# EAGLE design mqtt doorbell v2a (EAGLE 7.6.0)
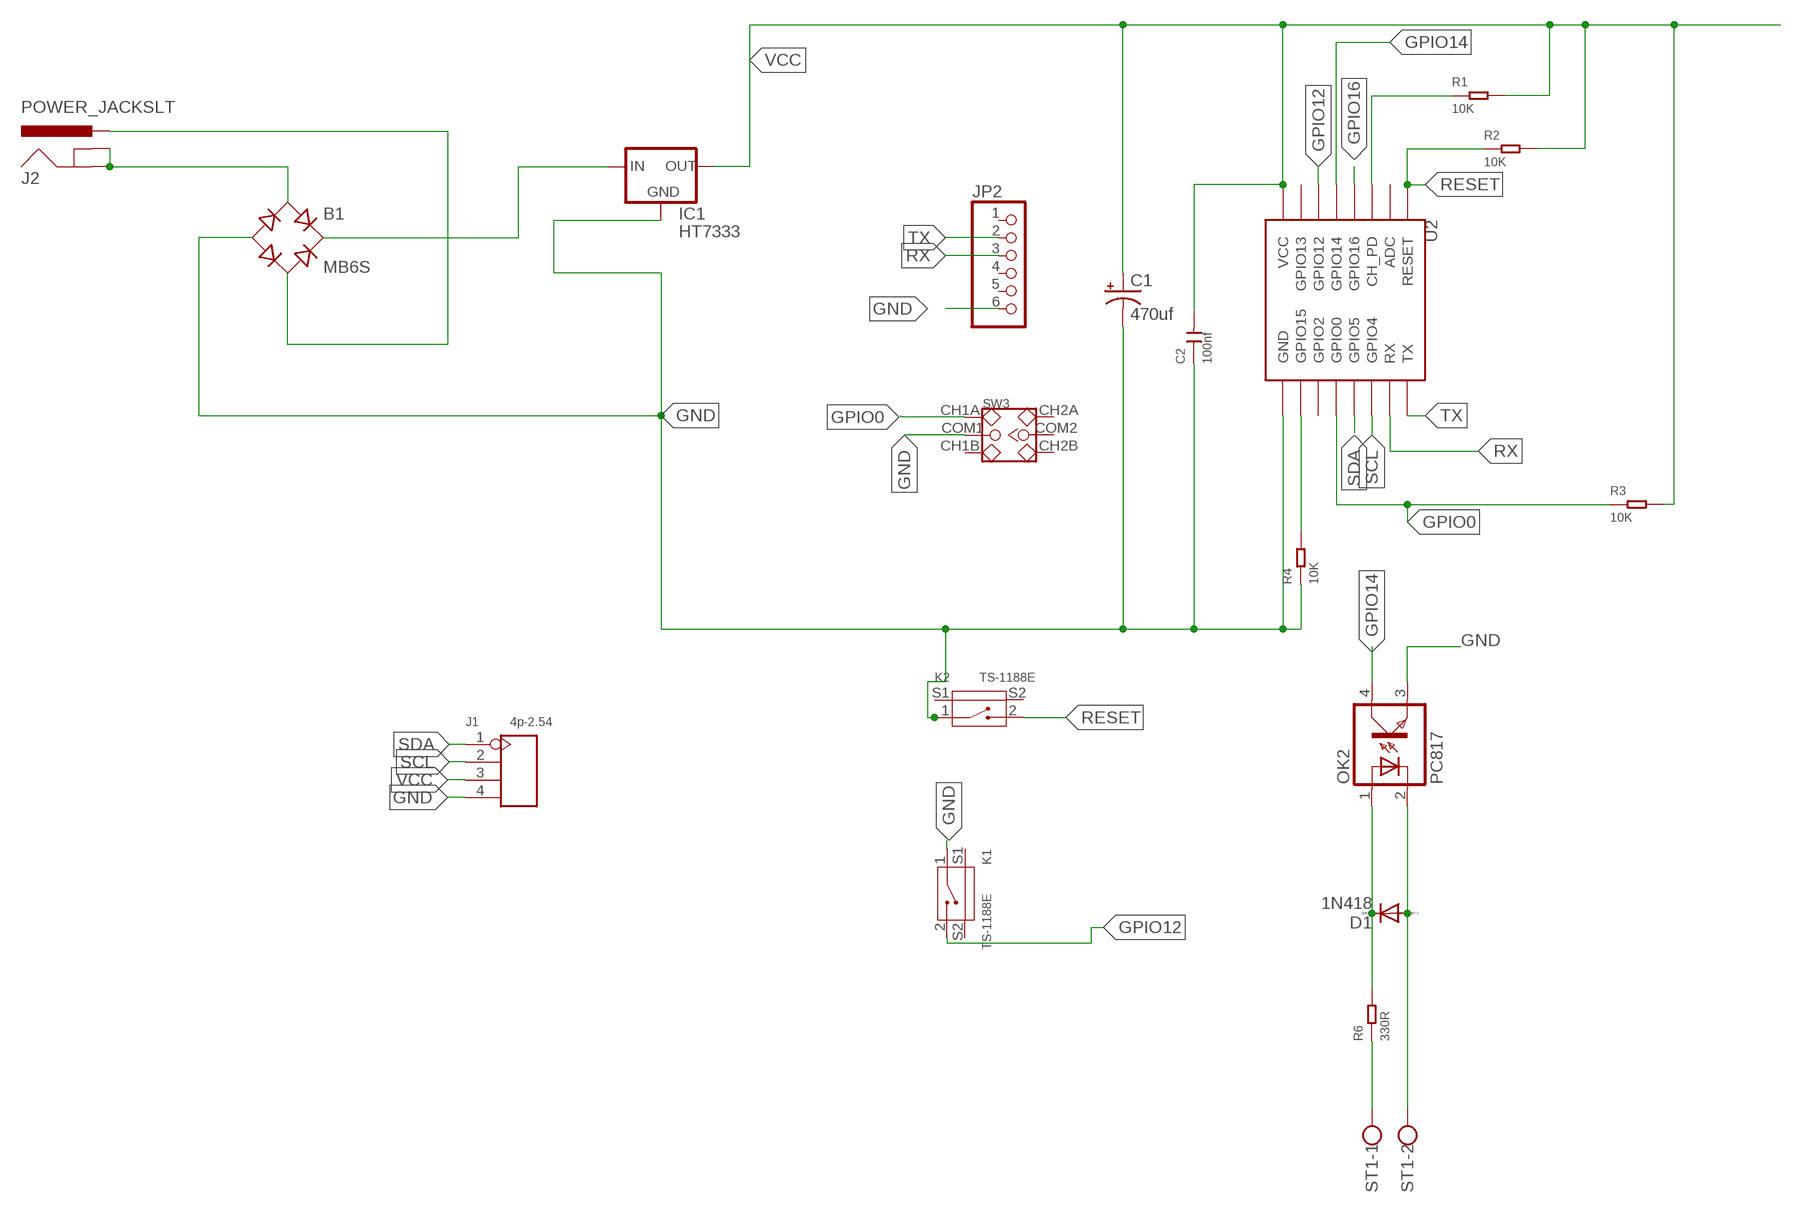
[diagram p0: schematic, sheet 1]

## Parts
B1  MB6S  MB4S  [SOIC-4]
C1  470uf  47UF-50V-20%(ELECT)  [PANASONIC_D]
C2  100nf  CERAMIC-100NF-50V-10%-X7R(0603)  [C0603]
D1  1N418  CGRM4001-G  [SOD-123_MINI-SMA]
IC1  HT7333  [SOT-89]
J1  4p-2.54  DIP-BLACK-FEMALE-HEADER-VERT(4P-2.54)  [H4-2.54]
J2  POWER_JACKSLT  [POWER_JACK_SLOT]
JP2  PINHD-1X6  [1X06]
K1  TS-1188E  SMD-BUTTON(2+2P-7X3.5MM-90D)  [SW4-SMD-7.0X3.5X3.5MM-90D]
K2  TS-1188E  SMD-BUTTON(2+2P-7X3.5MM-90D)  [SW4-SMD-7.0X3.5X3.5MM-90D]
OK2  PC817  TLP181  [SOP-4-2.54]
R1  10K  SMD-RES-10K-1%-1/10W(0603)  [R0603]
R2  10K  SMD-RES-10K-1%-1/10W(0603)  [R0603]
R3  10K  SMD-RES-10K-1%-1/10W(0603)  [R0603]
R4  10K  SMD-RES-10K-1%-1/10W(0603)  [R0603]
R6  330R  SMD-RES-330R-1%-1/10W(0603)  [R0603]
ST1  W237-102  [W237-102]
SW3  SMD-TOGGLE-SWITCH-2CH(2X3P-7X3.5MM)  [SW6-2.54-SMD-7.0X3.5X1.5MM]
U2  ESP12SMD  [ESP12-SMD]

## Nets
GND: B1.- C1.- C2.1 IC1.2(GND) J1.4 JP2.6 K1.1 K2.1 OK2.3(EMIT) R4.1 SW3.COM1 U2.GND
GPIO0: R3.1 SW3.CH1A U2.GPIO0
GPIO12: K1.2 U2.GPIO12
GPIO14: OK2.4(COL) U2.GPIO14
GPIO16: U2.GPIO16
L1: B1.+ IC1.3(IN) IC1.4(IN)
N$1: B1.~2(AC2) J2.PWR
N$3: D1.C OK2.1(A) R6.2
N$4: D1.A OK2.2(C) ST1.2
N$5: R1.1 U2.CH_PD
N$6: R6.1 ST1.1
N$7: R4.2 U2.GPIO15
N$9: B1.~1(AC1) J2.GND@1(GNDBREAK) J2.GND@2(GND)
RESET: K2.2 R2.1 U2.RESET
RX: JP2.3 U2.RXD0(RX)
SCL: J1.2 U2.GPIO4
SDA: J1.1 U2.GPIO5
TX: JP2.2 U2.TXD0(TX)
VCC: C1.+ C2.2 IC1.1(OUT) J1.3 R1.2 R2.2 R3.2 U2.VCC
Unconnected: JP2.1 JP2.4 JP2.5 K1.S1 K1.S2 K2.S1 K2.S2 SW3.CH1B SW3.CH2A SW3.CH2B SW3.COM2 U2.ADC U2.GPIO2 U2.GPIO13

## Library data of the parts
B1 = rectifier:MB*S: Bridge Rectifier Source: http://www.fairchildsemi.com/ds/MB/MB6S.pdf
C1 = SparkFun-Capacitors:47UF-50V-20%(ELECT): CAP-10547; PROD_ID: CAP-10547
C2 = Seeed-Capacitor:CERAMIC-100NF-50V-10%-X7R(0603): 302010138; MPN: CC0603KRX7R9BB104
D1 = diode:CGRM400*-G: Molded plasitc,JEDEC SOD-123/Mini SMA Source: Comchip CGRM4001-G.pdf
IC1 = Lemcke solutions:HT73*
J1 = Seeed-OPL-Connector:DIP-BLACK-FEMALE-HEADER-VERT(4P-2.54): 320030017; MPN: F185-1104A1BSYA1
J2 = Lemcke solutions:POWER_JACK: Power Jack Connector This is the standard 5.5mm barrel jack for power. The PTH is the most common, proven, reliable, footprint. The Slot footprint only works if the mill layer is transmitted to the PCB fab house so be warned. Here are the connectors we sell at SparkFun: DC Barrel Power Jack/Connector <https://www.sparkfun.com/products/119> (PRT-00119) DC Barrel Power Jack/Connector (SMD) <https://www.sparkfun.com/products/12748> (PRT-12748) DC Barrel Jack Adapter - Breadboard Compatible <https://www.sparkfun.com/products/10811> (PRT-10811) It is used on this SparkFun product (and many, many others): SparkFun RedBoard - Programmed with Arduino <https://www.sparkfun.com/products/12757> (DEV-12757) Also, if you need a mating power supply or connector, please check these out: Wall Adapter Power Supply - 9VDC 650mA <https://www.sparkfun.com/products/298> (TOL-00298) DC Barrel Jack Adapter - Male <https://www.sparkfun.com/products/10287> (PRT-10287); PROD_ID: PRT-00119
JP2 = pinhead:PINHD-1X6: PIN HEADER
K1 K2 = Seeed-Switch:SMD-BUTTON(2+2P-7X3.5MM-90D): 311020023; MPN: TS-1188E
OK2 = optocoupler:TLP181
R1-R4 = Seeed-Resistor:SMD-RES-10K-1%-1/10W(0603): 301010299; MPN: RC0603FR-0710KL
R6 = Seeed-Resistor:SMD-RES-330R-1%-1/10W(0603): 301010300; MPN: RC0603FR-07330RL
ST1 = con-wago-500:W237-102: WAGO SCREW CLAMP; MPN: 237-102; OC_FARNELL: unknown; OC_NEWARK: 70K9898
SW3 = Seeed-Switch:SMD-TOGGLE-SWITCH-2CH(2X3P-7X3.5MM): 311030005
U2 = esp8266modules:ESP12: ESP8266 Wifi module 12

## Net classes
0 default: width 0.203 mm, clearance 0.205 mm

## Board
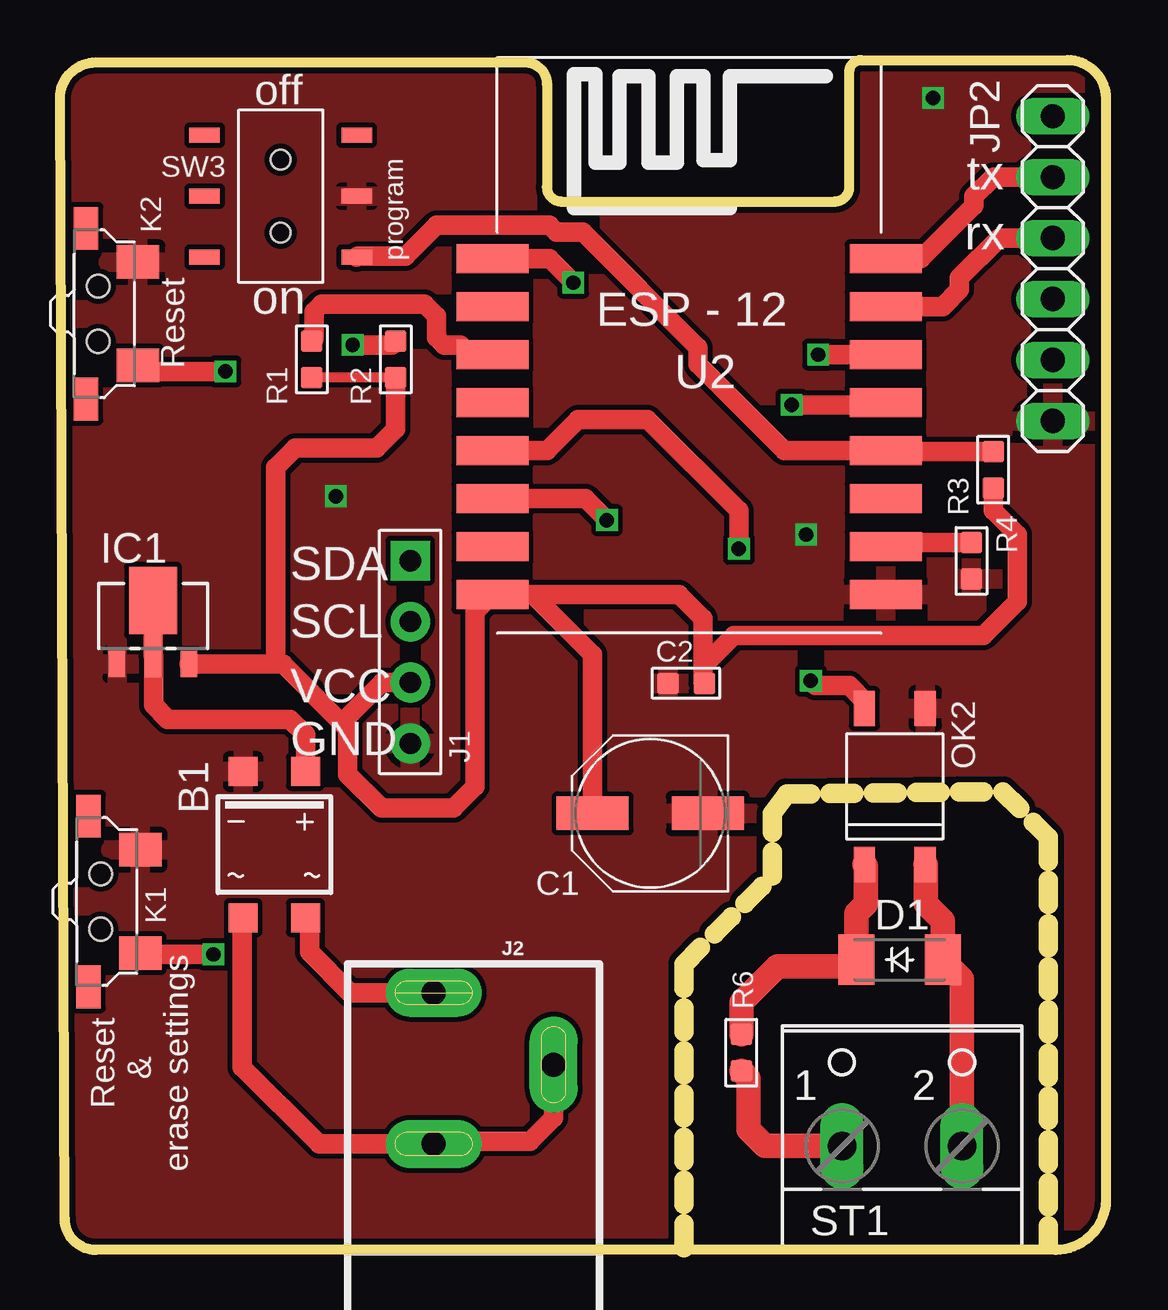
[diagram p1: board, top side]
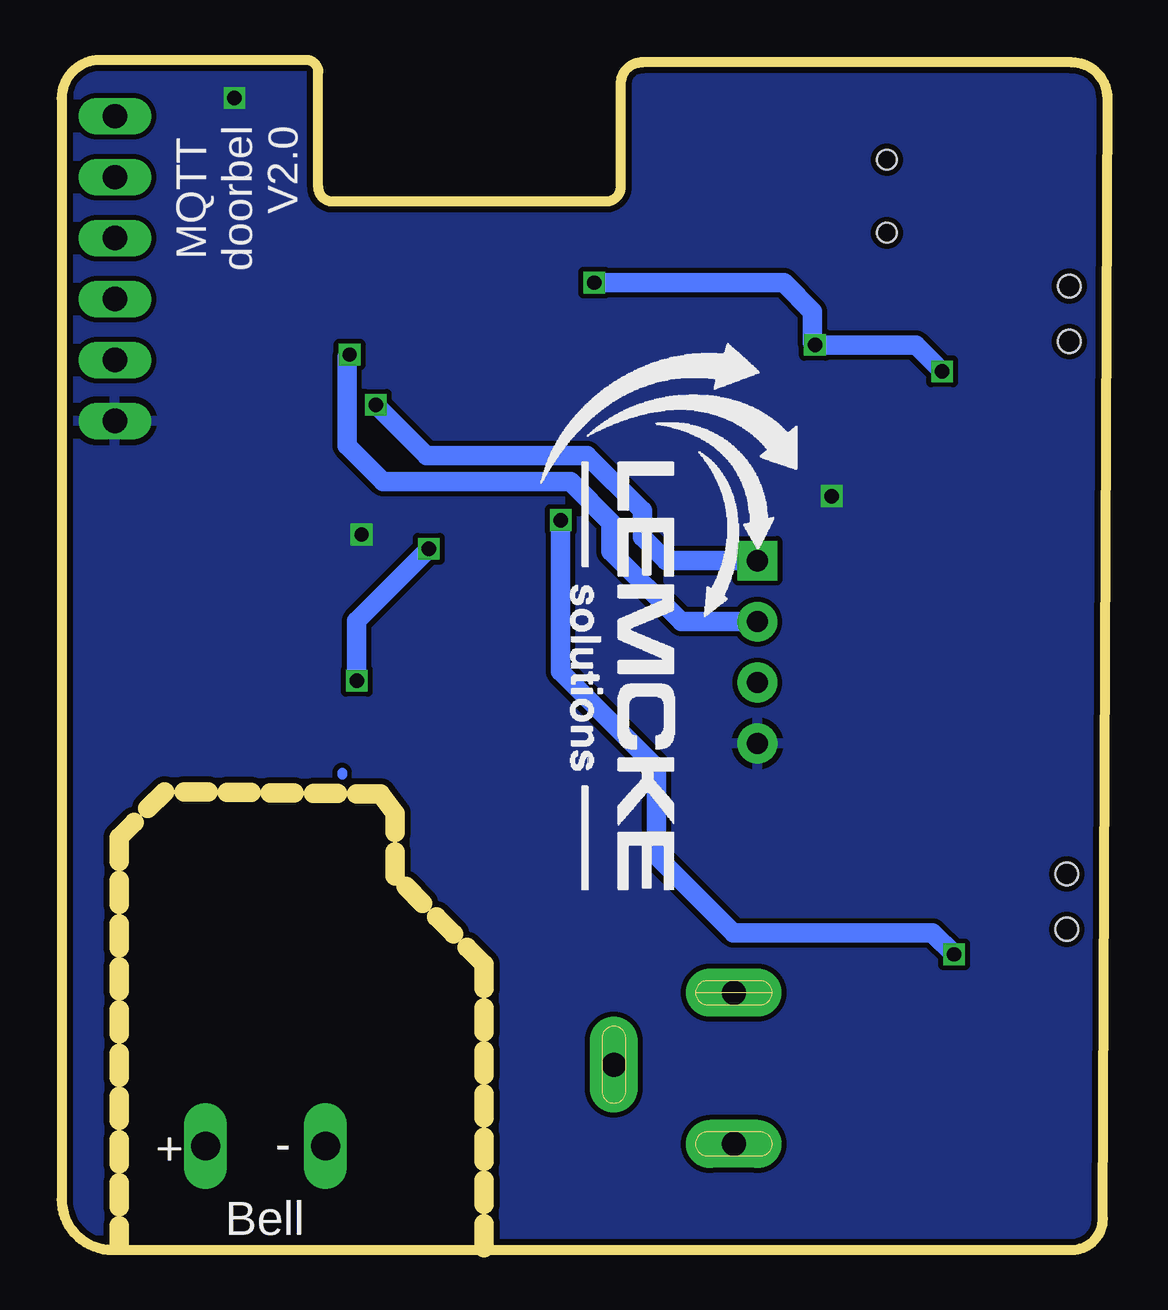
[diagram p2: board, bottom side, seen from below]

Size 43.6 x 49.6 mm. Coordinates in mm from the lower left corner, seen from the top.
Outline: 26,0.1 26,11.9 29.7,15.6 29.7,18.2 30.3,19 39.3,19.1 41.2,17.2 41.2,0.3
Outline: 0.2,1.3 0,48 arc-90 1.5,49.5 19.4,49.5 arc-90 20.3,48.6 20.3,44.3 arc90 20.9,43.7 32.3,43.7 arc90 32.9,44.3 32.9,49.1 arc-90 33.4,49.6 42,49.6 arc-90 43.6,48 43.6,2.1 arc-90 41.5,0 1.5,0 arc-90 0.2,1.3
Copper layers (1*16): Top 0.035mm / dielectric 1.5mm / Bottom 0.035mm
Design rules "SeeedStudio_2layer_DRU_no_angle_20140221": minimum track width 6mil, minimum drill 12mil, track to track 6mil, track to pad 6mil, pad to pad 6mil, via to via 6mil, smd to smd 0mil, copper to edge 10mil, drill to drill 10mil, minimum pad ring 10mil, minimum via ring 6mil, stop-mask expansion 2mil, vias tented up to drill 100mil, thermal gap 10mil

### Footprints (pad centres in the part's own frame; a part is rotated, then mirrored left to right if it is on the bottom)
SOIC-4 = smd 1.2 x 1.2: + 1.3,3.05; - -1.3,3.05; ~1 -1.3,-3.05; ~2 1.3,-3.05
PANASONIC_D = smd 3 x 1.4: + 2.4,0; - -2.4,0
C0603 = smd 0.889 x 0.889: 1 0,0.762; 2 0,-0.762
SOD-123_MINI-SMA = smd 1.5 x 2.1: A 1.8,0; C -1.8,0
SOT-89 = smd 0.7 x 1.1: 1 1.5,-2.385; 2 -1.5,-2.385 | smd 0.7 x 1.8: 3 0,-2.035 | smd 2 x 2.8: 4 0,0.265 | smd 0.635 x 1.27: P$1 0,-2.3; P$2 0,-1.6; P$3 0,-0.8; P$4 0,-0.2; P$5 0,0.3; P$6 -0.1,0.9
H4-2.54 = drill 0.889 pad 1.651 square: 1 0,3.81 | drill 0.889 pad 1.651: 2 0,1.27; 3 0,-1.27; 4 0,-3.81
POWER_JACK_SLOT = drill 1 pad 2 long: GND@1 2.58,7.5; GND@2 7.58,10.8; PWR 2.58,13.8
1X06 = drill 1.016 long: 1 -6.35,0; 2 -3.81,0; 3 -1.27,0; 4 1.27,0; 5 3.81,0; 6 6.35,0
SW4-SMD-7.0X3.5X3.5MM-90D = smd 1.397 x 1.778: 1 -2.159,1.651; 2 2.159,1.651 | smd 1.778 x 1.016: S1 -3.556,-0.508; S2 3.556,-0.508 | hole 0.95: -1.15,0; 1.15,0
SOP-4-2.54 = smd 0.889 x 1.448: 1 -1.27,-3.25; 2 1.27,-3.25; 3 1.27,3.25; 4 -1.27,3.25
R0603 = smd 0.889 x 0.889: 1 0,0.762; 2 0,-0.762
W237-102 = drill 1.194 long: 1 -2.5,-1.27; 2 2.5,-1.27
SW6-2.54-SMD-7.0X3.5X1.5MM = smd 1.27 x 0.635: CH1A -3.175,2.54; CH1B -3.175,-2.54; CH2A 3.175,2.54; CH2B 3.175,-2.54; COM1 -3.175,0; COM2 3.175,0 | hole 0.813: 0,1.524; 0,-1.524
ESP12-SMD = smd 3 x 1.2: ADC -8.3,3.8; CH_PD -8.3,1.8; GND 8.1,-8.2; GPIO0 8.1,-2.2; GPIO2 8.1,-4.2; GPIO4 8.1,1.8; GPIO5 8.1,-0.2; GPIO12 -8.3,-4.2; GPIO13 -8.3,-6.2; GPIO14 -8.3,-2.2; GPIO15 8.1,-6.2; GPIO16 -8.3,-0.2; RESET -8.3,5.8; RXD0 8.1,3.8; TXD0 8.1,5.8; VCC -8.3,-8.2

### Placement (x,y rotation side)
B1  8.94,16.89 0 top
C1  24.6,18.2 180 top
C2  26.1,23.62 90 top
D1  35,12.1 0 top
IC1  3.88,26.81 0 top
J1  14.6,24.92 0 top
J2  13,-3.08 0 top
JP2  41.38,40.91 270 top
K1  1.7,14.52 270 top
K2  1.6,39.02 270 top
OK2  34.8,19.32 0 top
R1  10.5,37.12 0 top
R2  14,37.12 0 top
R3  38.9,32.52 0 top
R4  38,28.72 180 top
R6  28.4,8.22 180 top
ST1  35.1,5.6 0 top
SW3  9.2,43.92 180 top
U2  26.32,35.51 0 top

### Tracks (layer width: path | path; a pad name or v marks a point on that pad's centre or on a via)
GND  (via drill 0.6)
  other vias: 11.5,31.42 36.4,48.02 31.1,29.82
  pour Bottom: -2.6,49.1 41.71,49.47 43.3,49.2 43.2,0.5 41.4,0.4 41.2,0.7 41.2,17.1 39,19.3 31.5,19.3 26.7,12.8 26.1,1.3 25.5,0.1 7.6,0.2 -0.7,-0.5 -3,33.1 -2.1,39.4
  pour Top: -0.5,59.42 49.5,59.42 49.5,-10.58 -0.5,-10.58
GPIO0
  Top 0.406: 34.46,33.28 U2.GPIO0
  Top 0.813: U2.GPIO0 30.21,33.31 26.6,36.92 26.6,37.62 21.8,42.42 20.7,42.42 20.4,42.72 15.7,42.72 14.4,41.42 12.41,41.42 SW3.CH1A | 34.46,33.28 R3.1
GPIO12  (via drill 0.6)
  Top 0.813: U2.GPIO12 21.91,31.31 v22.8,30.42 | v6.4,12.32 3.39,12.32 K1.2
  Bottom 0.813: v22.8,30.42 22.8,24.12 18.8,20.12 18.8,16.42 15.6,13.22 7.3,13.22 v6.4,12.32
GPIO14  (via drill 0.6)
  Top 0.813: OK2.4 33.53,22.89 32.9,23.52 31.5,23.52 v31.3,23.72 | v28.3,29.22 28.3,30.82 24.5,34.62 21.6,34.62 20.3,33.32 U2.GPIO14
  Bottom 0.813: v31.3,23.72 31.3,26.22 v28.3,29.22
GPIO16
  Top 0.406: 18.03,35.72 U2.GPIO16
L1
  Top 0.813: IC1.4 IC1.3 3.9,24.75 3.9,22.72 4.5,22.12 9.6,22.12 10.24,21.48 B1.+
N$1
  Top 0.813: J2.PWR 12.1,10.72 10.4,12.42 10.4,13.68 B1.~2
N$3
  Top 1.016: R6.2 28.4,10.32 29.9,11.82 32.92,11.82 D1.C 33.2,14.02 33.6,14.42 33.6,16 OK2.1
N$4
  Top 1.016: ST1.2 37.6,11.3 D1.A 36.8,13.72 36.1,14.42 36.1,16.04 OK2.2
N$5
  Top 0.406: U2.CH_PD 16.71,37.71
  Top 0.813: 16.71,37.71 16.01,37.71 15.7,38.02 15.7,38.92 15.2,39.42 10.9,39.42 10.6,39.12 10.6,37.98 R1.1
N$6
  Top 1.016: ST1.1 29.39,4.33 28.7,5.02 28.7,7.16 R6.1
N$7
  Top 0.813: R4.2 34.59,29.48 U2.GPIO15
N$8
  Bottom 0.406: 31.9,19.9 31.9,19.8
N$9
  Top 0.813: B1.~1 7.6,13.81 7.6,7.62 10.8,4.42 J2.GND@1 15.68,4.52 19.6,4.52 20.58,5.5 J2.GND@2
RESET  (via drill 0.6)
  Top 0.813: U2.RESET 20.41,41.31 v21.4,40.32 | v12.2,37.72 13.84,37.72 R2.1 | v6.9,36.62 3.49,36.62 K2.2
  Bottom 0.813: v21.4,40.32 13.5,40.32 12.3,39.12 12.3,37.82 v12.2,37.72 8,37.72 v6.9,36.62
RX
  Top 0.813: JP2.3 39.15,42.18 37.5,40.52 37.5,40.02 36.8,39.32 U2.RXD0
SCL  (via drill 0.6)
  Top 0.813: v31.6,37.32 34.42,37.32 U2.GPIO4
  Bottom 0.406: 31.5,37.22 v31.6,37.32
  Bottom 0.813: J1.2 17.77,26.19 20.7,29.12 20.7,30.32 22.4,32.02 30.2,32.02 31.7,33.52 31.7,37.22 v31.6,37.32
SDA  (via drill 0.6)
  Top 0.813: v30.5,35.22 34.33,35.22 U2.GPIO5
  Bottom 0.813: J1.1 18.41,28.73 19.4,29.72 19.4,30.82 21.7,33.12 28.4,33.12 v30.5,35.22
TX
  Top 0.813: U2.TXD0 35.89,41.31 38.1,43.52 38.1,43.92 38.9,44.72 JP2.2
VCC
  Top 0.406: R2.2 R1.2 | R3.2 38.9,31.62 | 9,24.82 8.6,24.42 | C2.2 26.86,23.92
  Top 0.813: IC1.1 8.6,24.42 9.3,24.42 11.75,21.97 | 11.75,21.97 12,21.72 12,19.82 13.4,18.42 16.4,18.42 17.3,19.32 17.3,26.59 U2.VCC 19.7,27.31 | R2.2 14,34.22 13.2,33.42 9.8,33.42 9,32.62 9,24.82 | J1.3 13.43,23.65 11.75,21.97 | 19.7,27.31 25.81,27.31 26.8,26.32 26.8,24.32 | 26.8,24.32 26.8,23.68 C2.2 | 38.9,31.62 38.9,30.82 39.9,29.82 39.9,27.02 38.5,25.62 28.1,25.62 26.8,24.32 | C1.+ 22.2,24.81 19.7,27.31

### Text on the board
tPlace: off | tx | rx | program | on | Reset | SDA | SCL | VCC | GND | Reset / & / erase settings
bPlace: MQTT / doorbel / V2.0 | - | + | Bell